# EAGLE design main (EAGLE 7.7.0)
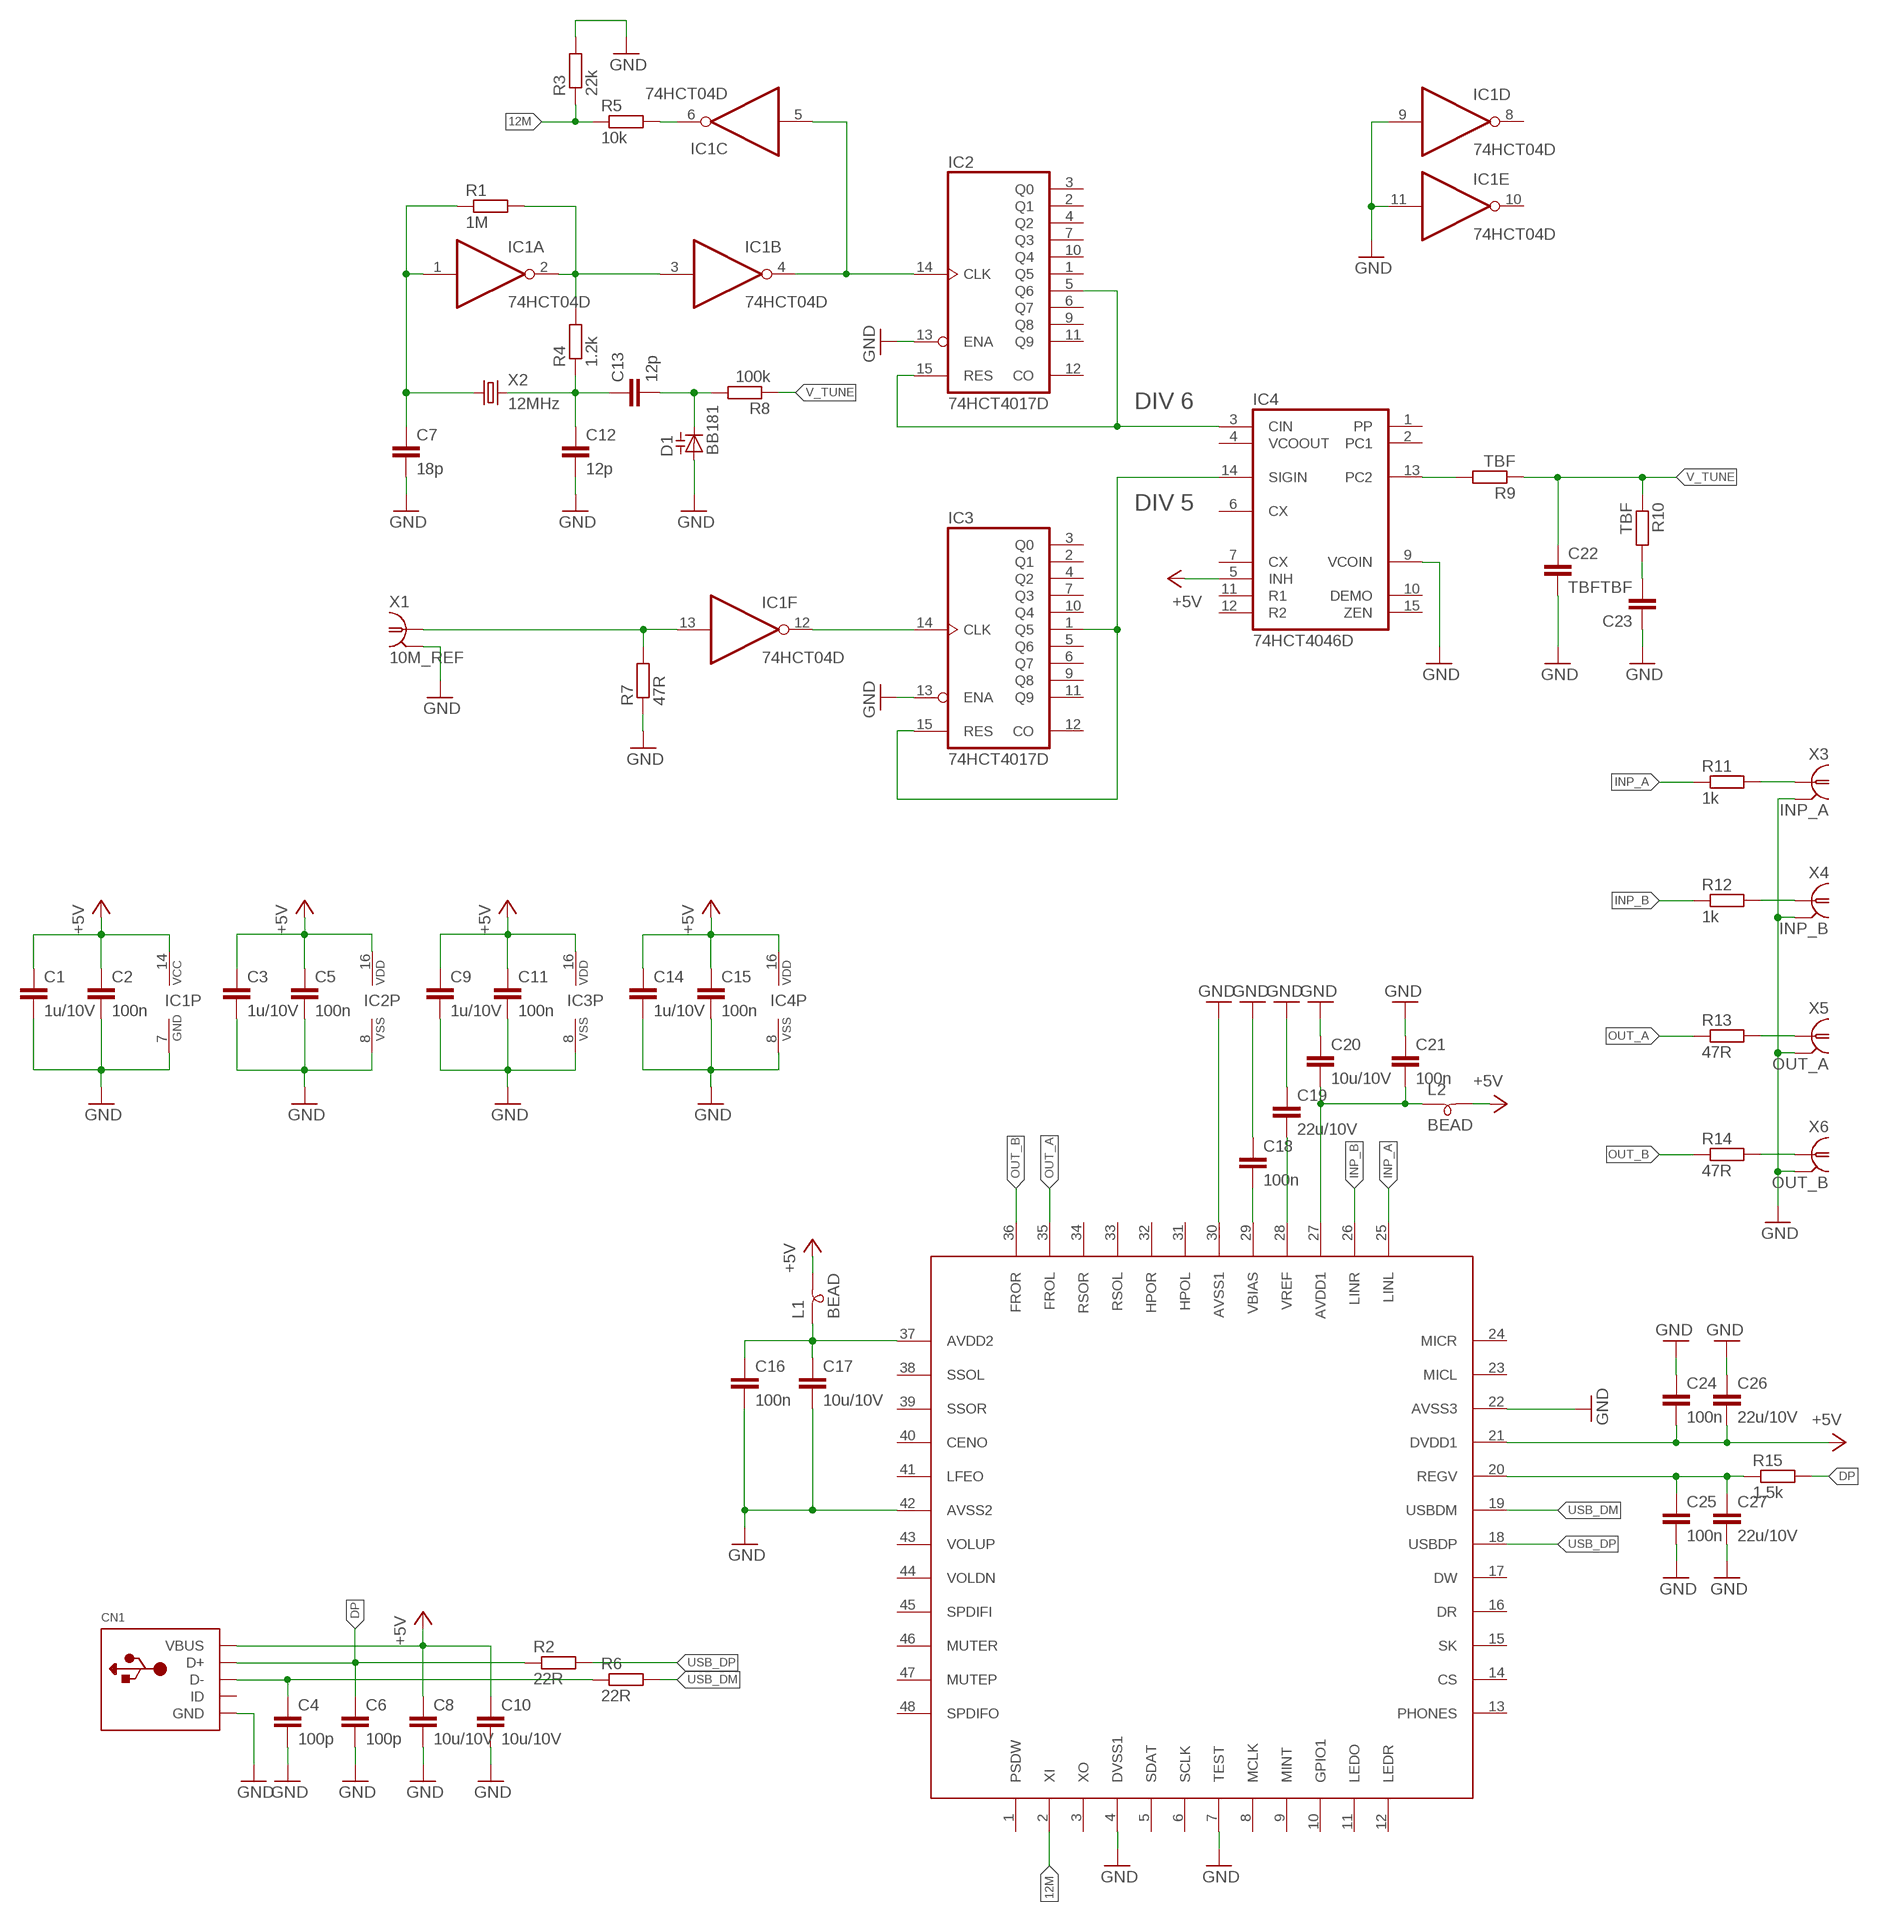
[diagram p0: schematic, sheet 1]

## Parts
C1  1u/10V  C-EUC0805  [C0805]
C2  100n  C-EUC0805  [C0805]
C3  1u/10V  C-EUC0805  [C0805]
C4  100p  C-EUC0805  [C0805]
C5  100n  C-EUC0805  [C0805]
C6  100p  C-EUC0805  [C0805]
C7  18p  C-EUC0805  [C0805]
C8  10u/10V  C-EUC1206  [C1206]
C9  1u/10V  C-EUC0805  [C0805]
C10  10u/10V  C-EUC1206  [C1206]
C11  100n  C-EUC0805  [C0805]
C12  12p  C-EUC0805  [C0805]
C13  12p  C-EUC0805  [C0805]
C14  1u/10V  C-EUC0805  [C0805]
C15  100n  C-EUC0805  [C0805]
C16  100n  C-EUC0805  [C0805]
C17  10u/10V  C-EUC0805  [C0805]
C18  100n  C-EUC0805  [C0805]
C19  22u/10V  C-EUC0805  [C0805]
C20  10u/10V  C-EUC0805  [C0805]
C21  100n  C-EUC0805  [C0805]
C22  TBF  C-EUC0805  [C0805]
C23  TBF  C-EUC0805  [C0805]
C24  100n  C-EUC0805  [C0805]
C25  100n  C-EUC0805  [C0805]
C26  22u/10V  C-EUC0805  [C0805]
C27  22u/10V  C-EUC0805  [C0805]
CN1  USBMINIB  [USB-MINIB]
D1  BB181  BB141  [SOD523]
IC1  74HCT04D  [SO14]
IC2  74HCT4017D  4017D  [SO16]
IC3  74HCT4017D  4017D  [SO16]
IC4  74HCT4046D  4046D  [SO16]
L1  BEAD  SM-B5  [SM-B5]
L2  BEAD  SM-B5  [SM-B5]
R1  1M  R-EU_R0805  [R0805]
R2  22R  R-EU_R0805  [R0805]
R3  22k  R-EU_R0805  [R0805]
R4  1.2k  R-EU_R0805  [R0805]
R5  10k  R-EU_R0805  [R0805]
R6  22R  R-EU_R0805  [R0805]
R7  47R  R-EU_R0805  [R0805]
R8  100k  R-EU_R0805  [R0805]
R9  TBF  R-EU_R0805  [R0805]
R10  TBF  R-EU_R0805  [R0805]
R11  1k  R-EU_R0805  [R0805]
R12  1k  R-EU_R0805  [R0805]
R13  47R  R-EU_R0805  [R0805]
R14  47R  R-EU_R0805  [R0805]
R15  1.5k  R-EU_R0805  [R0805]
U1  CM6206  [LQFP-48]
X1  10M_REF  1-227161-2  [AMP_227161]
X2  12MHz  CRYSTALS-NOGND-HC49/4H  [HC49]
X3  INP_A  1-227161-2  [AMP_227161]
X4  INP_B  1-227161-2  [AMP_227161]
X5  OUT_A  1-227161-2  [AMP_227161]
X6  OUT_B  1-227161-2  [AMP_227161]

## Nets
12M: R3.1 R5.1 U1.2(XI)
+5V: C1.1 C2.1 C3.1 C5.1 C8.1 C9.1 C10.1 C11.1 C14.1 C15.1 C24.2 C26.2 CN1.VBUS IC1.14(P:VCC) IC2.16(VDD) IC3.16(VDD) IC4.5(INH) IC4.16(VDD) L1.2 L2.2 U1.21(DVDD1)
DP: C6.1 CN1.D+ R2.1 R15.2
GND: C1.2 C2.2 C3.2 C4.2 C5.2 C6.2 C7.2 C8.2 C9.2 C10.2 C11.2 C12.2 C14.2 C15.2 C16.2 C17.2 C18.1 C19.1 C20.1 C21.1 C22.2 C23.1 C24.1 C25.2 C26.1 C27.2 CN1.GND D1.A IC1.7(P:GND) IC1.9(D:I) IC1.11(E:I) IC2.8(VSS) IC2.13(ENA) IC3.8(VSS) IC3.13(ENA) IC4.8(VSS) IC4.9(VCOIN) R3.2 R7.1 U1.4(DVSS1) U1.7(TEST) U1.22(AVSS3) U1.30(AVSS1) U1.42(AVSS2) X1.2 X3.2 X4.2 X5.2 X6.2
INP_A: R11.1 U1.25(LINL)
INP_B: R12.1 U1.26(LINR)
N$1: C4.1 CN1.D- R6.1
N$2: IC3.1(Q5) IC3.15(RES) IC4.14(SIGIN)
N$3: R13.2 X5.1
N$4: R14.2 X6.1
N$5: R12.2 X4.1
N$6: R11.2 X3.1
N$7: C16.1 C17.1 L1.1 U1.37(AVDD2)
N$8: C7.1 IC1.1(A:I) R1.1 X2.1
N$9: IC1.13(F:I) R7.2 X1.1
N$10: IC2.5(Q6) IC2.15(RES) IC4.3(CIN)
N$11: C18.2 U1.29(VBIAS)
N$13: C19.2 U1.28(VREF)
N$14: C12.1 C13.1 R4.1 X2.2
N$17: IC1.2(A:O) IC1.3(B:I) R1.2 R4.2
N$18: C13.2 D1.C R8.2
N$19: IC1.4(B:O) IC1.5(C:I) IC2.14(CLK)
N$20: IC1.12(F:O) IC3.14(CLK)
N$21: IC4.13(PC2) R9.2
N$22: C20.2 C21.2 L2.1 U1.27(AVDD1)
N$23: C23.2 R10.2
N$26: IC1.6(C:O) R5.2
N$27: C25.1 C27.1 R15.1 U1.20(REGV)
OUT_A: R13.1 U1.35(FROL)
OUT_B: R14.1 U1.36(FROR)
USB_DM: R6.2 U1.19(USBDM)
USB_DP: R2.2 U1.18(USBDP)
V_TUNE: C22.1 R8.1 R9.1 R10.1
Unconnected: CN1.ID IC1.8(D:O) IC1.10(E:O) IC2.1(Q5) IC2.2(Q1) IC2.3(Q0) IC2.4(Q2) IC2.6(Q7) IC2.7(Q3) IC2.9(Q8) IC2.10(Q4) IC2.11(Q9) IC2.12(CO) IC3.2(Q1) IC3.3(Q0) IC3.4(Q2) IC3.5(Q6) IC3.6(Q7) IC3.7(Q3) IC3.9(Q8) IC3.10(Q4) IC3.11(Q9) IC3.12(CO) IC4.1(PP) IC4.2(PC1) IC4.4(VCOOUT) IC4.6(CX) IC4.7(CX) IC4.10(DEMO) IC4.11(R1) IC4.12(R2) IC4.15(ZEN) U1.1(PSDW) U1.3(XO) U1.5(SDAT) U1.6(SCLK) U1.8(MCLK) U1.9(MINT) U1.10(GPIO1) U1.11(LEDO) U1.12(LEDR) U1.13(PHONES) U1.14(CS) U1.15(SK) U1.16(DR) U1.17(DW) U1.23(MICL) U1.24(MICR) U1.31(HPOL) U1.32(HPOR) U1.33(RSOL) U1.34(RSOR) U1.38(SSOL) U1.39(SSOR) U1.40(CENO) U1.41(LFEO) U1.43(VOLUP) U1.44(VOLDN) U1.45(SPDIFI) U1.46(MUTER) U1.47(MUTEP) U1.48(SPDIFO)

## Notes on the sheet
- DIV 6
- DIV 5

## Library data of the parts
C1-C27 = rcl:C-EU: CAPACITOR, European symbol
CN1 = adafruit:USB: USB Connectors USBMINIB - Surface Mount Female Mini-B USB Connector 4UConnector: 06564 By microbuilder.eu Thru-hole RA Female Mini-B USB Connector 4UConnector: 18732 By ladyada.net
D1 = diode:BB141: Capacity DIODE variable-capacitance diode
IC1 = 74xx-eu:74*04: Hex INVERTER
IC2 IC3 = 40xx:4017: COUNTER/DIVIDER
IC4 = 40xx:4046: Micropower PLL
L1 L2 = inductor-neosid:SM-B: INDUCTOR SMD Bead inductor; OC_FARNELL: unknown; OC_NEWARK: unknown
R1-R15 = rcl:R-EU_: RESISTOR, European symbol
U1 = cmedia:CM6206
X1 X3-X6 = con-coax:?227161*: JACK, RIGHT ANGLE, 50 OHM, PCB, BNC Source: amp_227161.pdf; OC_FARNELL: unknown; OC_NEWARK: unknown
X2 = IQD-Frequency-Products:CRYSTALS-NOGND: CRYSTALS CAN NOT GROUNDED

## Board
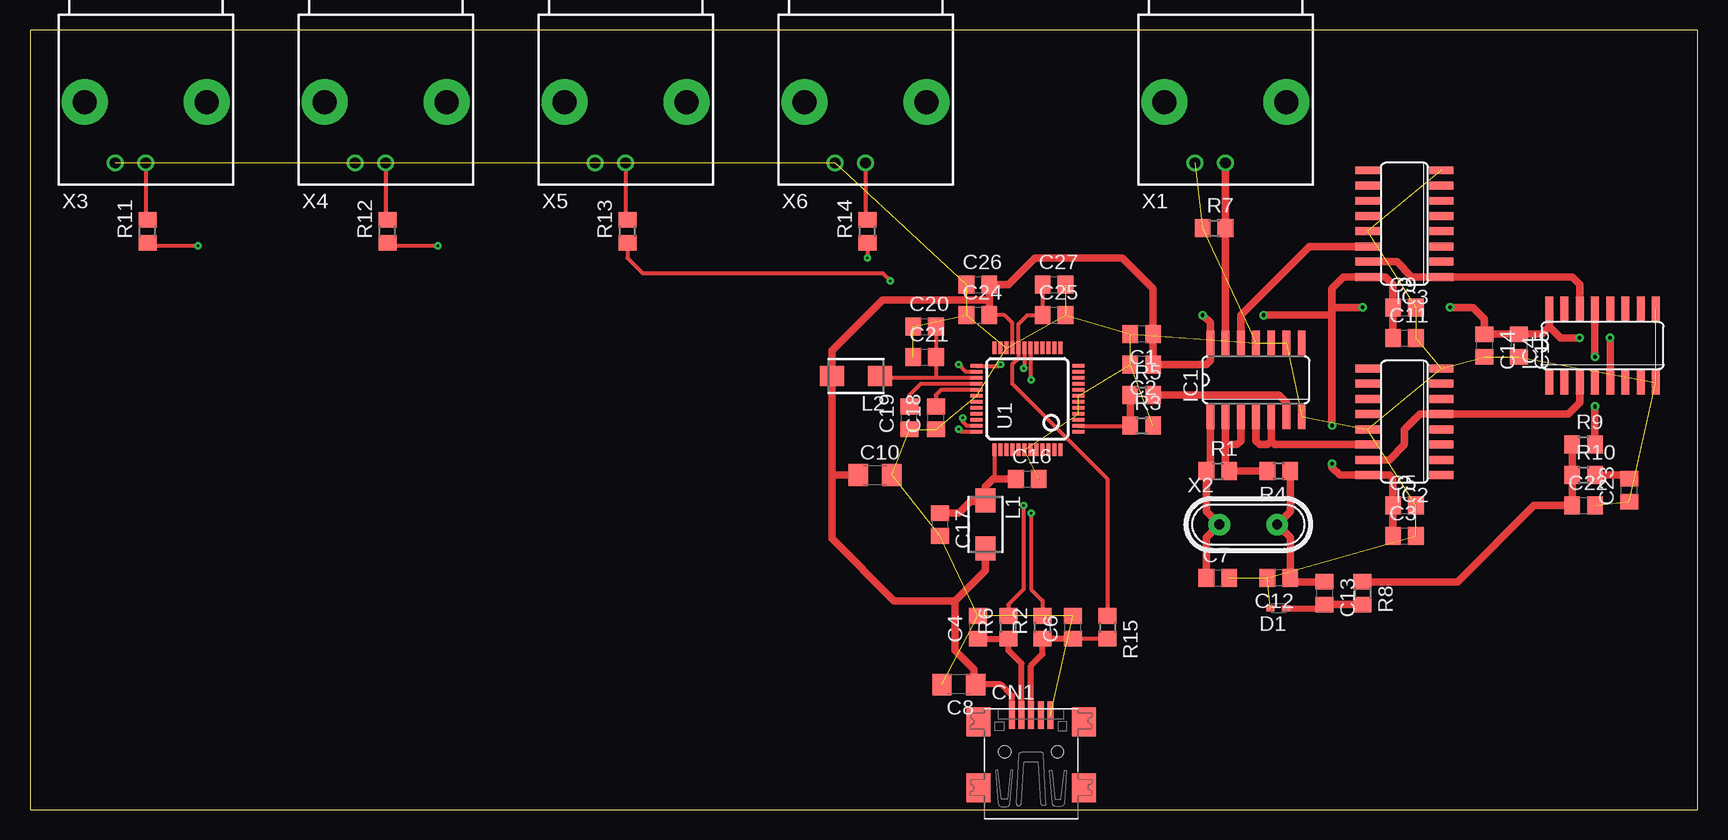
[diagram p1: board, top side]
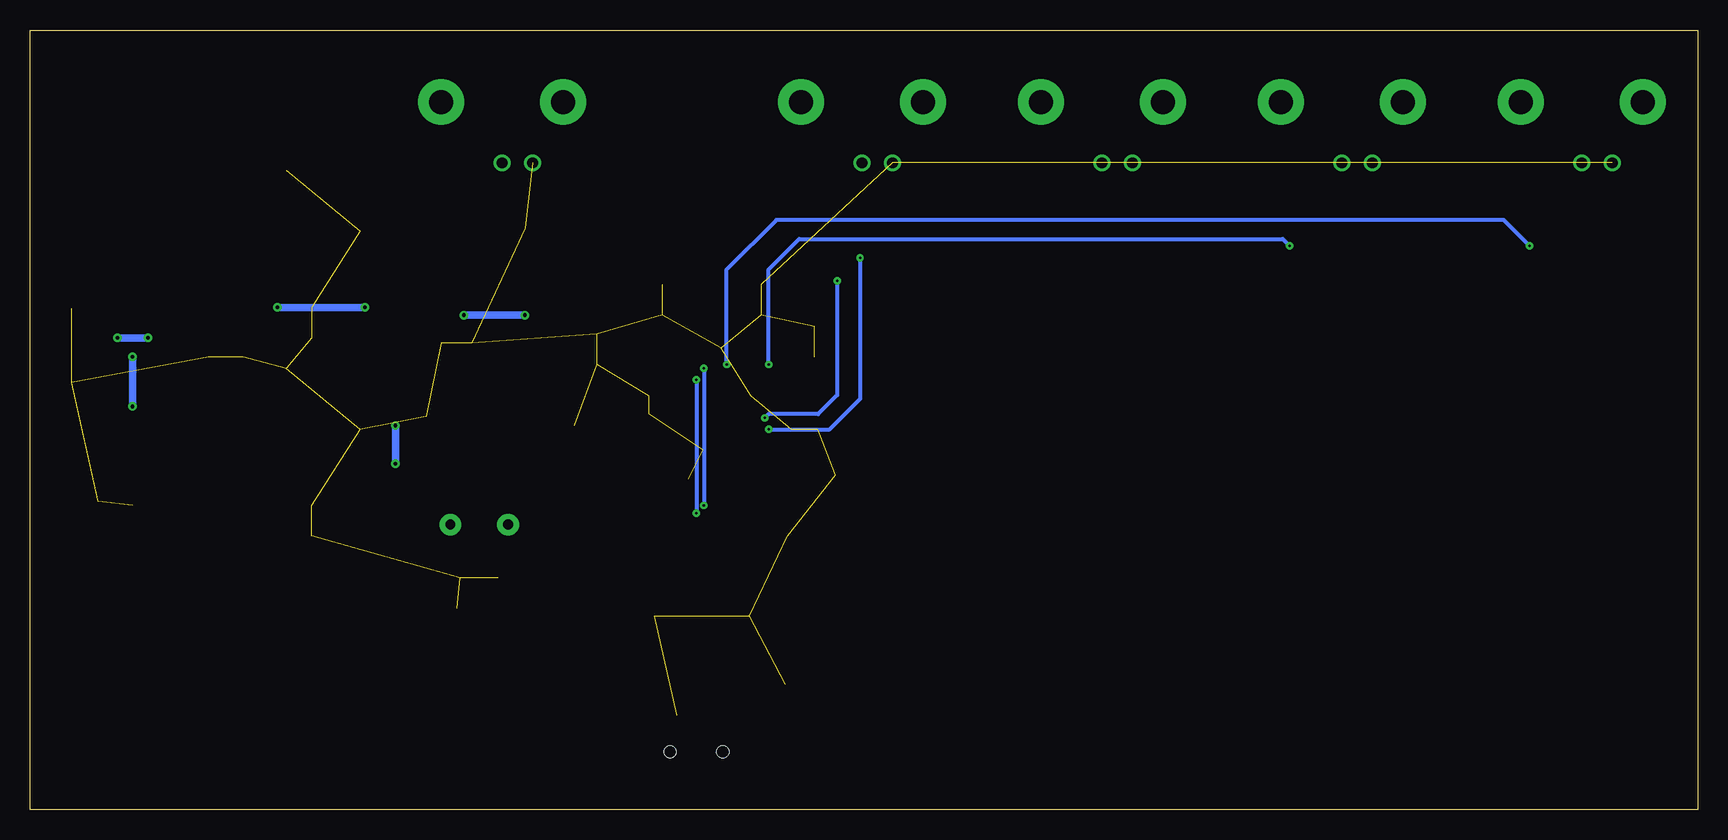
[diagram p2: board, bottom side, seen from below]

Size 139 x 65 mm. Coordinates in mm from the lower left corner, seen from the top.
Outline: 0,0 139,0 139,65 0,65 0,0
Copper layers (1*16): Top 0.035mm / dielectric 1.5mm / Bottom 0.035mm
Design rules "default": minimum track width 10mil, minimum drill 24mil, track to track 8mil, track to pad 8mil, pad to pad 8mil, via to via 8mil, smd to smd 8mil, copper to edge 40mil, drill to drill 8mil, minimum pad ring 10mil, minimum via ring 8mil, stop-mask expansion 4mil, vias tented up to drill 0mil, thermal gap 10mil

### Footprints (pad centres in the part's own frame; a part is rotated, then mirrored left to right if it is on the bottom)
C0805 = smd 1.3 x 1.5: 1 -0.95,0; 2 0.95,0
C1206 = smd 1.6 x 1.8: 1 -1.4,0; 2 1.4,0
USB-MINIB = smd 0.5 x 2.308: D+ 0,4.064; D- -0.8,4.064; GND 1.6,4.064; ID 0.8,4.064; VBUS -1.6,4.064 | smd 2 x 2.4: GND1 -4.4,-2; GND2 -4.4,3.5; GND3 4.4,3.5; GND4 4.4,-2 | hole 1: -2.2,1; 2.2,1
SOD523 = smd 0.7 x 0.5: A 0.7,0; C -0.6,0
SO14 = smd 0.66 x 2.032: 1 -3.81,-3.073; 2 -2.54,-3.073; 3 -1.27,-3.073; 4 0,-3.073; 5 1.27,-3.073; 6 2.54,-3.073; 7 3.81,-3.073; 8 3.81,3.073; 9 2.54,3.073; 10 1.27,3.073; 11 0,3.073; 12 -1.27,3.073; 13 -2.54,3.073; 14 -3.81,3.073
SO16 = smd 0.66 x 2.032: 1 -4.445,-3.073; 2 -3.175,-3.073; 3 -1.905,-3.073; 4 -0.635,-3.073; 5 0.635,-3.073; 6 1.905,-3.073; 7 3.175,-3.073; 8 4.445,-3.073; 9 4.445,3.073; 10 3.175,3.073; 11 1.905,3.073; 12 0.635,3.073; 13 -0.635,3.073; 14 -1.905,3.073; 15 -3.175,3.073; 16 -4.445,3.073
SM-B5 = smd 2 x 1.7: 1 -2,0; 2 2,0
R0805 = smd 1.3 x 1.5: 1 -0.95,0; 2 0.95,0
LQFP-48 = smd 0.318 x 1.016: 1 -2.75,-4.25; 2 -2.25,-4.25; 3 -1.75,-4.25; 4 -1.25,-4.25; 5 -0.75,-4.25; 6 -0.25,-4.25; 7 0.25,-4.25; 8 0.75,-4.25; 9 1.25,-4.25; 10 1.75,-4.25; 11 2.25,-4.25; 12 2.75,-4.25; 25 2.75,4.25; 26 2.25,4.25; 27 1.75,4.25; 28 1.25,4.25; 29 0.75,4.25; 30 0.25,4.25; 31 -0.25,4.25; 32 -0.75,4.25; 33 -1.25,4.25; 34 -1.75,4.25; 35 -2.25,4.25; 36 -2.75,4.25 | smd 1.016 x 0.318: 13 4.25,-2.75; 14 4.25,-2.25; 15 4.25,-1.75; 16 4.25,-1.25; 17 4.25,-0.75; 18 4.25,-0.25; 19 4.25,0.25; 20 4.25,0.75; 21 4.25,1.25; 22 4.25,1.75; 23 4.25,2.25; 24 4.25,2.75; 37 -4.25,2.75; 38 -4.25,2.25; 39 -4.25,1.75; 40 -4.25,1.25; 41 -4.25,0.75; 42 -4.25,0.25; 43 -4.25,-0.25; 44 -4.25,-0.75; 45 -4.25,-1.25; 46 -4.25,-1.75; 47 -4.25,-2.25; 48 -4.25,-2.75
AMP_227161 = drill 0.9 pad 1.27: 1 0,-5.08; 2 -2.54,-5.08 | drill 2 pad 3.81: P$1 -5.08,0; P$2 5.08,0
HC49 = drill 0.813 pad 1.8: 1 -2.413,0; 2 2.413,0

### Placement (x,y rotation side)
C1  92.67,39.64 180 top
C2  92.67,37.1 180 top
C3  114.57,22.81 0 top
C4  79.01,15.19 90 top
C5  114.57,25.35 0 top
C6  86.95,15.19 90 top
C7  99.02,19.32 0 top
C8  77.42,10.43 180 top
C9  114.57,41.86 0 top
C10  70.44,27.89 0 top
C11  114.57,39.32 0 top
C12  104.09,19.32 180 top
C13  107.91,18.05 270 top
C14  121.24,38.69 270 top
C15  124.1,38.69 270 top
C16  83.14,27.57 0 top
C17  75.84,23.77 270 top
C18  75.52,32.66 90 top
C19  73.3,32.66 90 top
C20  74.57,40.27 0 top
C21  74.57,37.73 0 top
C22  129.5,25.35 0 top
C23  133.31,26.62 90 top
C24  79.01,41.23 0 top
C25  85.36,41.23 0 top
C26  79.01,43.77 0 top
C27  85.36,43.77 0 top
CN1  83.46,3.81 0 top
D1  104.09,16.78 180 top
IC1  102.19,35.83 0 top
IC2  114.57,32.34 90 top
IC3  114.57,48.85 90 top
IC4  131.08,38.69 0 top
L1  79.65,23.77 270 top
L2  68.85,36.15 180 top
R1  99.02,28.21 0 top
R2  84.41,15.19 90 top
R3  92.67,32.02 0 top
R4  104.09,28.21 180 top
R5  92.67,34.56 0 top
R6  81.55,15.19 90 top
R7  98.7,48.48 0 top
R8  111.08,18.05 270 top
R9  129.5,30.43 0 top
R10  129.5,27.89 0 top
R11  9.8,48.21 90 top
R12  29.8,48.21 90 top
R13  49.8,48.21 90 top
R14  69.81,48.21 90 top
R15  89.81,15.19 270 top
U1  83.14,34.24 90 top
X1  99.65,59 0 top
X2  101.56,23.77 0 top
X3  9.65,59 0 top
X4  29.65,59 0 top
X5  49.65,59 0 top
X6  69.65,59 0 top

### Tracks (layer width: path | path; a pad name or v marks a point on that pad's centre or on a via)
12M
  Top 0.318: U1.2 91.69,31.99 R3.1
  Top 0.61: R5.1 R3.1
+5V  (via drill 0.3)
  Top 0.318: U1.21 81.89,40.57 81.23,41.23 C24.2
  Top 0.508: CN1.VBUS 81.86,9.49 80.92,10.43 C8.1
  Top 0.61: C9.1 113.62,43.77 112.98,44.4 IC3.16 109.49,44.4 108.54,43.45 108.54,41.86 | C9.1 | C9.1 113.62,39.64 C11.1 | C5.1 113.62,27.57 113.3,27.89 IC2.16 109.17,27.89 108.54,28.53 v108.54,28.84 | C5.1 | C5.1 C3.1 | 126.64,40.27 126,39.64 C15.1 C14.1 121.24,40.91 120.29,41.86 v118.38,41.86 | 126.64,40.27 IC4.16 | IC4.5 v131.72,39.32 | v129.18,39.32 127.59,39.32 126.64,40.27 | 108.54,41.86 108.54,41.23 | 108.54,41.23 v108.54,32.02 | v97.75,41.23 98.38,40.59 IC1.14 98.38,37.42 98.06,37.1 C2.1 C1.1 93.61,43.45 91.08,45.99 83.78,45.99 81.55,43.77 C26.2 79.96,42.5 | v102.83,41.23 108.54,41.23 | v111.08,41.86 108.54,41.86 | L1.2 79.65,19.95 77.11,17.41 | 77.11,17.41 77.11,13.29 78.69,11.7 78.69,10.56 C8.1 | 79.96,42.5 C24.2 | 66.85,27.89 L2.2 66.85,38.27 71.08,42.5 79.96,42.5 | 66.85,27.89 66.85,22.59 72.03,17.41 77.11,17.41 | C10.1 66.85,27.89
  Bottom 0.61: v131.72,39.32 v129.18,39.32 | v108.54,32.02 v108.54,28.84 | v97.75,41.23 v102.83,41.23 | v118.38,41.86 v111.08,41.86
DP
  Top 0.318: R15.2 C6.1
  Top 0.508: C6.1 R2.1 84.41,12.97 83.46,12.02 CN1.D+
GND  (48 unrouted)
INP_A  (via drill 0.2)
  Top 0.318: U1.25 80.81,36.99 v80.92,37.1 | v14,47 10.06,47 R11.1
  Bottom 0.318: v80.92,37.1 80.92,45.04 76.79,49.16 16.16,49.16 v14,47
INP_B  (via drill 0.2)
  Top 0.318: U1.26 78.03,36.49 v77.42,37.1 | v34,47 30.06,47 R12.1
  Bottom 0.318: v77.42,37.1 77.42,45.04 74.89,47.58 34.58,47.58 v34,47
N$1
  Top 0.508: C4.1 R6.1 81.55,13.29 82.66,12.18 CN1.D-
N$2
  Top 0.61: IC3.15 113.94,45.67 115.21,44.4 IC3.1 128.54,44.4 129.18,43.77 IC4.14
N$3
  Top 0.318: X5.1 49.65,49.31 R13.2
N$4
  Top 0.318: X6.1 69.65,49.32 R14.2
N$5
  Top 0.318: X4.1 29.65,49.31 R12.2
N$6
  Top 0.318: X3.1 9.65,49.31 R11.2
N$7
  Top 0.318: 79.55,25.67 L1.1 | U1.37 80.39,27.68 80.28,27.57
  Top 0.61: C17.1 77.42,24.71 78.38,25.67 79.55,25.67 | L1.1 79.65,26.94 80.28,27.57 C16.1
N$8
  Top 0.61: IC1.1 98.38,28.52 R1.1 98.06,24.84 X2.1 98.06,22.69 C7.1
N$9
  Top 0.61: X1.1 99.65,49.48 R7.2 IC1.13
N$10
  Top 0.61: IC2.15 113.3,29.16 114.57,30.43 114.57,31.7 115.84,32.97 IC2.5 128.22,32.97 129.18,33.92 IC4.3
N$11
  Top 0.318: U1.29 75.95,34.99 75.52,34.56 C18.2
N$13
  Top 0.318: U1.28 74.23,35.49 73.3,34.56 C19.2
N$14
  Top 0.61: R4.1 105.05,24.84 X2.2 105.05,22.69 C12.1 105.36,19 C13.1
N$17
  Top 0.61: IC1.2 99.65,30.43 | 99.65,30.43 99.65,28.52 R1.2 R4.2 | IC1.3 100.92,30.75 100.6,30.43 99.65,30.43
N$18
  Top 0.483: D1.C 107.58,16.78 C13.2
  Top 0.61: C13.2 R8.2
N$19
  Top 0.61: IC1.4 102.19,30.75 102.51,30.43 103.14,30.43 103.46,30.75 | 103.46,30.75 IC1.5 | IC2.14 103.78,30.43 103.46,30.75
N$20
  Top 0.61: IC1.12 100.92,41.23 106.64,46.94 IC3.14
N$21  (via drill 0.3)
  Top 0.61: IC4.13 v130.45,37.73 | v130.45,33.61 R9.2
  Bottom 0.61: v130.45,37.73 v130.45,33.61
N$22
  Top 0.318: U1.27 75.52,35.99 | 75.52,35.99 71.64,35.99 L2.1 | 75.52,35.99 C21.2 C20.2
N$23
  Top 0.61: R10.2 132.99,27.89 C23.2
N$26
  Top 0.61: R5.2 104.09,34.56 104.73,33.92 IC1.6
N$27
  Top 0.318: R15.1 89.81,27.57 81.87,35.51 81.87,37.1 82.39,37.62 U1.20 82.39,40.48 83.14,41.23 C25.1 C27.1
OUT_A  (via drill 0.2)
  Top 0.318: R13.1 49.8,45.99 51.07,44.72 71.08,44.72 v71.71,44.09 | v77.74,32.66 77.74,32.34 78.09,31.99 U1.35
  Bottom 0.318: v71.71,44.09 71.71,34.56 73.3,32.97 77.42,32.97 v77.74,32.66
OUT_B  (via drill 0.2)
  Top 0.318: R14.1 v69.81,45.99 | U1.36 77.64,31.49 v77.42,31.7
  Bottom 0.318: v69.81,45.99 69.81,34.24 72.34,31.7 v77.42,31.7
USB_DM  (via drill 0.2)
  Top 0.318: U1.19 82.89,36.85 v82.82,36.78 | v82.82,25.35 82.82,18.37 81.55,17.1 R6.2
  Bottom 0.318: v82.82,36.78 v82.82,25.35
USB_DP  (via drill 0.2)
  Top 0.318: U1.18 83.39,35.9 v83.46,35.83 | v83.46,24.72 83.46,18.37 84.41,17.41 R2.2
  Bottom 0.318: v83.46,35.83 v83.46,24.72
V_TUNE
  Top 0.61: R9.1 R10.1 C22.1 125.37,25.35 119.02,19 R8.1